# EAGLE design RFID-Parking-System (EAGLE 6.4)
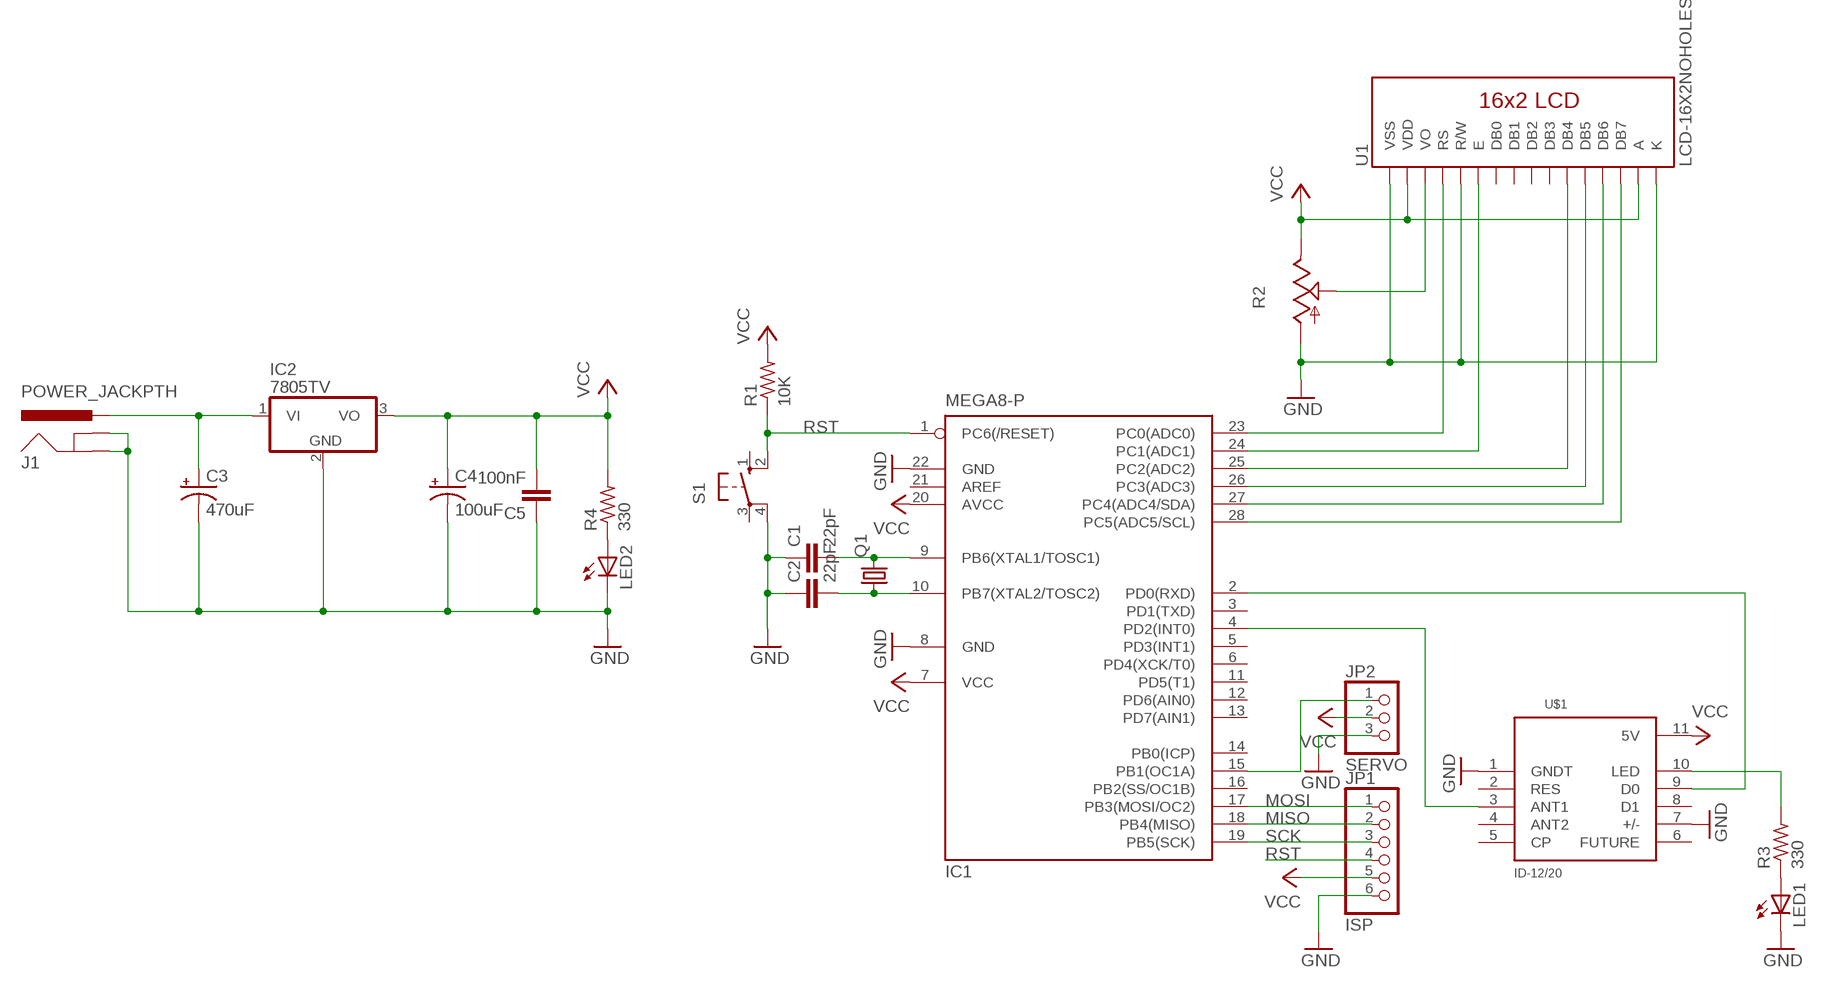
[diagram p0: schematic, sheet 1]

## Parts
C1  22pF  C-EU025-024X044  [C025-024X044]
C2  22pF  C-EU025-024X044  [C025-024X044]
C3  470uF  CPOL-USE2.5-6  [E2,5-6]
C4  100uF  CPOL-USE2.5-6  [E2,5-6]
C5  100nF  C-EU025-024X044  [C025-024X044]
IC1  MEGA8-P  [DIL28-3]
IC2  7805TV  [TO220V]
J1  POWER_JACKPTH  [POWER_JACK_PTH]
JP1  ISP  PINHD-1X6  [1X06]
JP2  SERVO  PINHD-1X3  [1X03]
LED1  LED3MM  [LED3MM]
LED2  LED3MM  [LED3MM]
Q1  CRYSTALHC49S  [HC49/S]
R1  10K  R-US_0207/10  [0207/10]
R2  TRIM_US-CA6V  [CA6V]
R3  330  R-US_0207/10  [0207/10]
R4  330  R-US_0207/10  [0207/10]
S1  10-XX  [B3F-10XX]
U1  LCD-16X2NOHOLES  [LCD-16X2_NOHOLES]
U$1  ID-12/20  [ID-12]

## Nets
GND: C1.1 C2.1 C3.- C4.- C5.1 IC1.8(GND) IC1.22(GND) IC2.2(GND) J1.GND J1.GNDBREAK JP1.6 JP2.3 LED1.K(C) LED2.K(C) R2.A S1.4(P1) U1.1(VSS) U1.5(R/W) U1.16(K) U$1.1(GNDT) U$1.7(+/-)
MISO: IC1.18(PB4(MISO)) JP1.2
MOSI: IC1.17(PB3(MOSI/OC2)) JP1.1
N$1: C1.2 IC1.9(PB6(XTAL1/TOSC1)) Q1.2
N$2: C2.2 IC1.10(PB7(XTAL2/TOSC2)) Q1.1
N$3: IC1.15(PB1(OC1A)) JP2.1
N$5: R2.S U1.3(VO)
N$6: IC1.23(PC0(ADC0)) U1.4(RS)
N$7: IC1.24(PC1(ADC1)) U1.6(E)
N$8: IC1.25(PC2(ADC2)) U1.11(DB4)
N$9: IC1.26(PC3(ADC3)) U1.12(DB5)
N$10: IC1.27(PC4(ADC4/SDA)) U1.13(DB6)
N$11: IC1.28(PC5(ADC5/SCL)) U1.14(DB7)
N$12: IC1.4(PD2(INT0)) U$1.3(ANT1)
N$13: IC1.2(PD0(RXD)) U$1.9(D0)
N$14: LED1.A R3.1
N$15: R3.2 U$1.10(LED)
N$16: C3.+ IC2.1(VI) J1.PWR
N$17: LED2.A R4.1
RST: IC1.1(PC6(/RESET)) JP1.4 R1.1 S1.2(S1)
SCK: IC1.19(PB5(SCK)) JP1.3
VCC: C4.+ C5.2 IC1.7(VCC) IC1.20(AVCC) IC2.3(VO) JP1.5 JP2.2 R1.2 R2.E R4.2 U1.2(VDD) U1.15(A) U$1.11(5V)
Unconnected: IC1.3(PD1(TXD)) IC1.5(PD3(INT1)) IC1.6(PD4(XCK/T0)) IC1.11(PD5(T1)) IC1.12(PD6(AIN0)) IC1.13(PD7(AIN1)) IC1.14(PB0(ICP)) IC1.16(PB2(SS/OC1B)) IC1.21(AREF) S1.1(S) S1.3(P) U1.7(DB0) U1.8(DB1) U1.9(DB2) U1.10(DB3) U$1.2(RES) U$1.4(ANT2) U$1.5(CP) U$1.6(FUTURE) U$1.8(D1)

## Library data of the parts
C1 C2 C5 = resistor:C-EU: CAPACITOR, European symbol
C3 C4 = rcl:CPOL-US: POLARIZED CAPACITOR, American symbol
IC1 = atmel:MEGA8-P: MICROCONTROLLER 8 Kbytes FLASH, 1 kbytes SRAM, 512 bytes EEPROM, USART, 4-channel 10 bit ADC, 2-channel 8 bit ADC Pin compatible with Atmega48, ATMega88, ATMega168 Source: avr.lbr; OC_FARNELL: unknown; OC_NEWARK: unknown
IC2 = linear:78*: Positive VOLTAGE REGULATOR Source: http://cache.national.com/ds/LM/LM78L05.pdf http://www.fairchildsemi.com/ds/LM/LM7805.pdf
J1 = SparkFun-Connectors:POWER_JACK: Power Jack This is the standard 5.5mm barrel jack for power. The PTH is the most common, proven, reliable, footprint. The Slot footprint only works if the mill layer is transmitted to the PCB fab house so be warned. Mating wall wart : TOL-00298 (and others); PROD_ID: PRT-00119
JP1 = pinhead:PINHD-1X6: PIN HEADER
JP2 = pinhead:PINHD-1X3: PIN HEADER
LED1 LED2 = led:LED: LED OSRAM: - CHIPLED LG R971, LG N971, LY N971, LG Q971, LY Q971, LO R971, LY R971 LH N974, LH R974 LS Q976, LO Q976, LY Q976 LO Q996 - Hyper CHIPLED LW Q18S LB Q993, LB Q99A, LB R99A - SideLED LS A670, LO A670, LY A670, LG A670, LP A670 LB A673, LV A673, LT A673, LW A673 LH A674 LY A675 LS A676, LA A676, LO A676, LY A676, LW A676 LS A679, LY A679, LG A679 - Hyper Micro SIDELED® LS Y876, LA Y876, LO Y876, LY Y876 LT Y87S - SmartLED LW L88C, LW L88S LB L89C, LB L89S, LG L890 LS L89K, LO L89K, LY L89K LS L896, LA L896, LO L896, LY L896 - TOPLED LS T670, LO T670, LY T670, LG T670, LP T670 LSG T670, LSP T670, LSY T670, LOP T670, LYG T670 LG T671, LOG T671, LSG T671 LB T673, LV T673, LT T673, LW T673 LH T674 LS T676, LA T676, LO T676, LY T676, LB T676, LH T676, LSB T676, LW T676 LB T67C, LV T67C, LT T67C, LS T67K, LO T67K, LY T67K, LW E67C LS E67B, LA E67B, LO E67B, LY E67B, LB E67C, LV E67C, LT E67C LW T67C LS T679, LY T679, LG T679 LS T770, LO T770, LY T770, LG T770, LP T770 LB T773, LV T773, LT T773, LW T773 LH T774 LS E675, LA E675, LY E675, LS T675 LS T776, LA T776, LO T776, LY T776, LB T776 LHGB T686 LT T68C, LB T68C - Hyper Mini TOPLED® LB M676 - Mini TOPLED Santana® LG M470 LS M47K, LO M47K, LY M47K Source: http://www.osram.convergy.de LUXEON: - LUMILED® LXK2-PW12-R00, LXK2-PW12-S00, LXK2-PW14-U00, LXK2-PW14-V00 LXK2-PM12-R00, LXK2-PM12-S00, LXK2-PM14-U00 LXK2-PE12-Q00, LXK2-PE12-R00, LXK2-PE12-S00, LXK2-PE14-T00, LXK2-PE14-U00 LXK2-PB12-K00, LXK2-PB12-L00, LXK2-PB12-M00, LXK2-PB14-N00, LXK2-PB14-P00, LXK2-PB14-Q00 LXK2-PR12-L00, LXK2-PR12-M00, LXK2-PR14-Q00, LXK2-PR14-R00 LXK2-PD12-Q00, LXK2-PD12-R00, LXK2-PD12-S00 LXK2-PH12-R00, LXK2-PH12-S00 LXK2-PL12-P00, LXK2-PL12-Q00, LXK2-PL12-R00 Source: www.luxeon.com KINGBRIGHT: KA-3528ASYC Source: www.kingbright.com
Q1 = crystal:CRYSTAL: CRYSTAL; OC_FARNELL: 1667008; OC_NEWARK: unknown
R1 R3 R4 = resistor:R-US_: RESISTOR, American symbol
R2 = pot:TRIM_US-: POTENTIOMETER
S1 = switch-omron:10-XX: OMRON SWITCH; MPN: B3F-1000; OC_FARNELL: 176432; OC_NEWARK: 36M3542
U1 = SparkFun-Displays:LCD-16X2: Standard text-only 16x2 parallel input LCD
U$1 = SparkFun-RF:ID-12/20: RFID reader for ID2, ID12, and ID20 Package

## Board
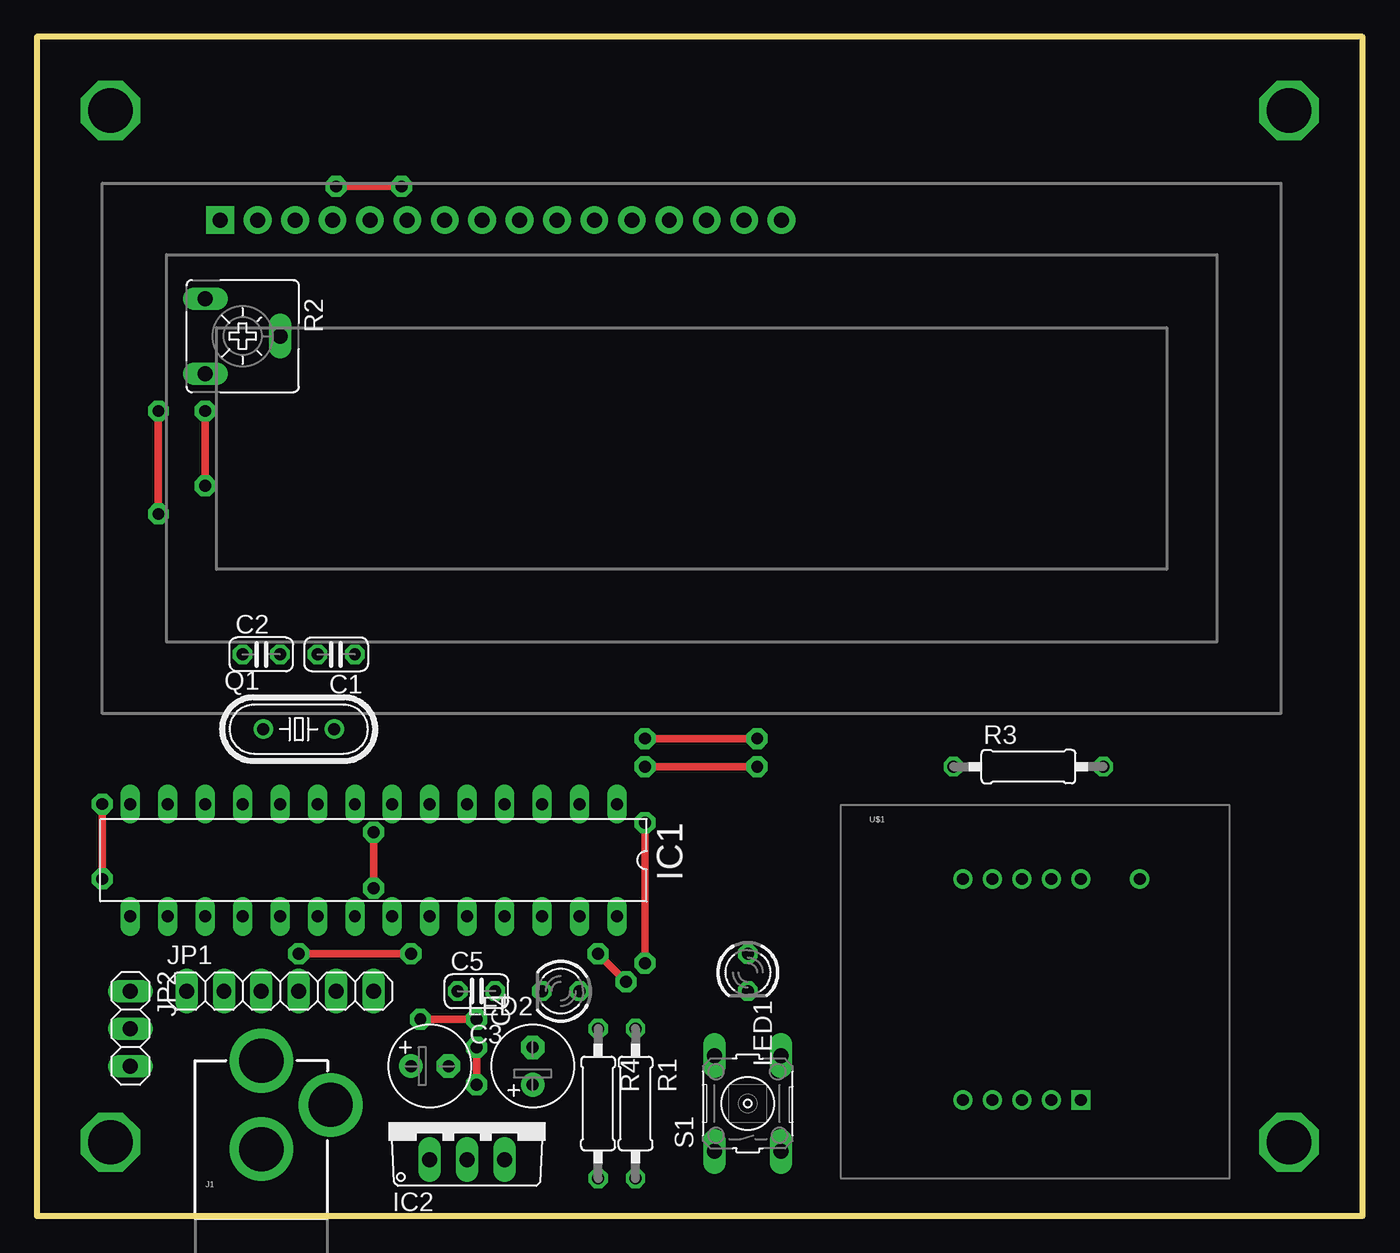
[diagram p1: board, top side]
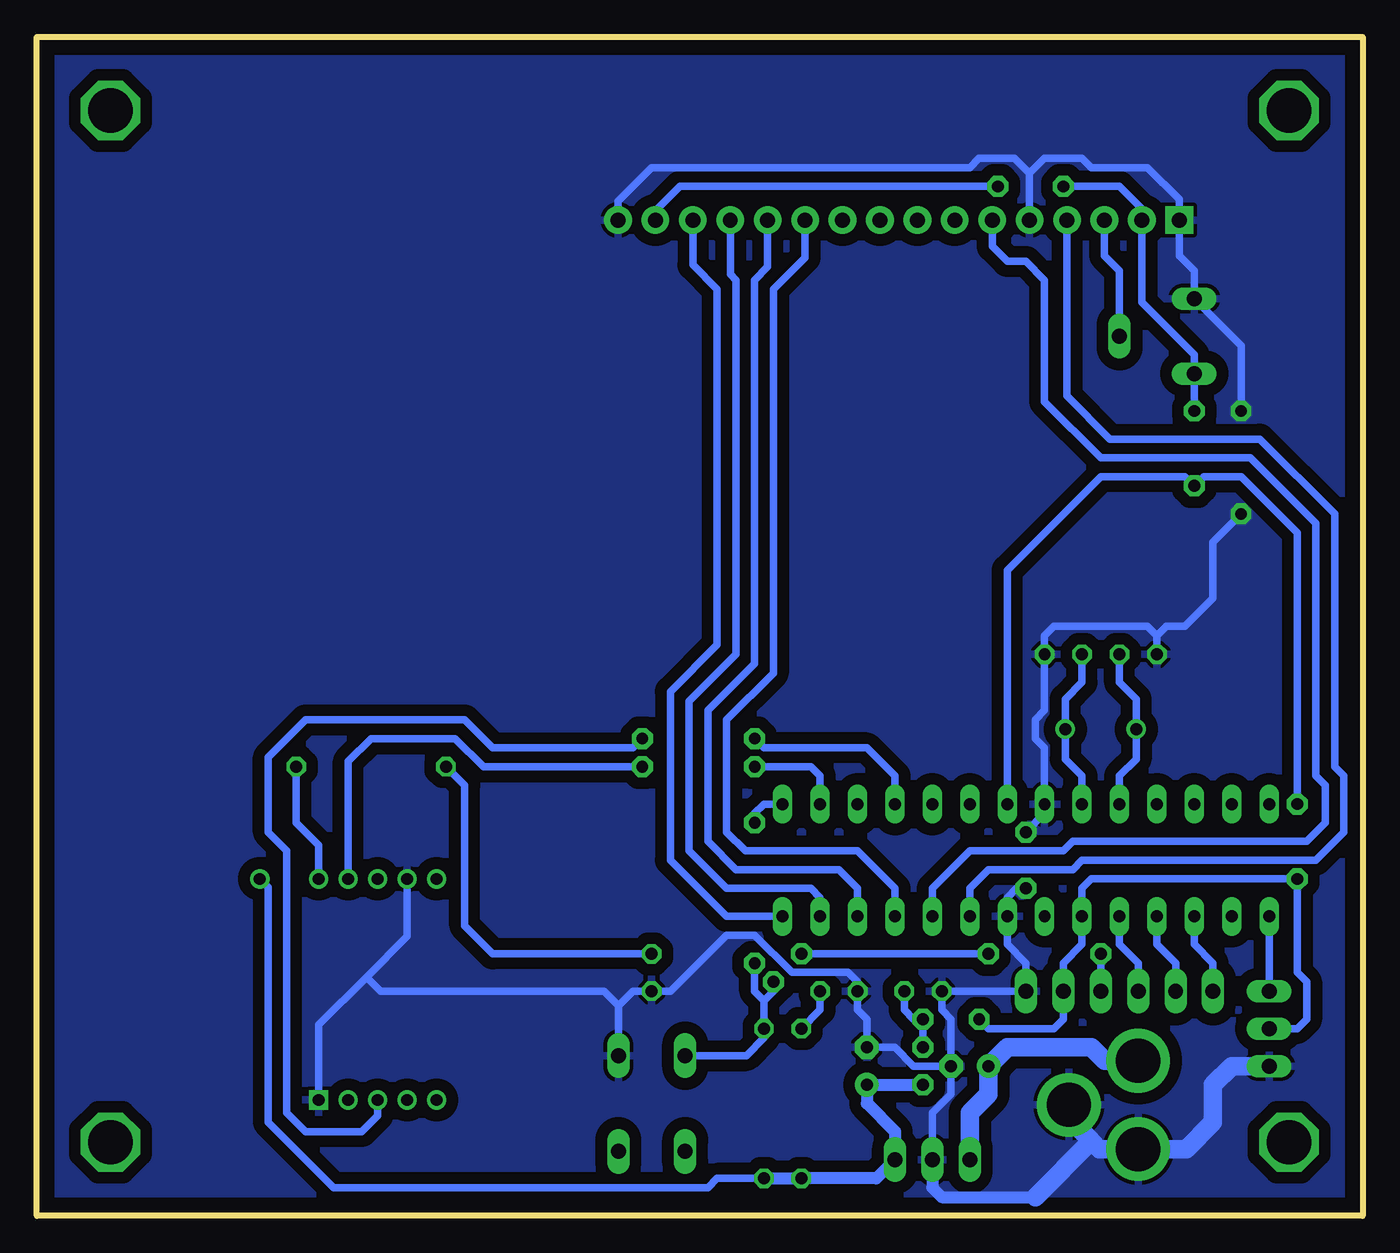
[diagram p2: board, bottom side, seen from below]

Size 90 x 80 mm. Coordinates in mm from the lower left corner, seen from the top.
Outline: 0,0 90,0 90,80 0,80 0,0
Copper layers (1*16): Top 0.035mm / dielectric 1.5mm / Bottom 0.035mm
Design rules "default": minimum track width 10mil, minimum drill 24mil, track to track 8mil, track to pad 8mil, pad to pad 8mil, via to via 8mil, smd to smd 8mil, copper to edge 40mil, drill to drill 8mil, minimum pad ring 10mil, minimum via ring 8mil, stop-mask expansion 4mil, vias tented up to drill 0mil, thermal gap 10mil

### Footprints (pad centres in the part's own frame; a part is rotated, then mirrored left to right if it is on the bottom)
C025-024X044 = drill 0.813 octagon: 1 -1.27,0; 2 1.27,0
E2,5-6 = drill 0.813 pad 1.6: + -1.27,0 | drill 0.813 pad 1.6 octagon: - 1.27,0
DIL28-3 = drill 0.813 long: 1 -16.51,-3.81; 2 -13.97,-3.81; 3 -11.43,-3.81; 4 -8.89,-3.81; 5 -6.35,-3.81; 6 -3.81,-3.81; 7 -1.27,-3.81; 8 1.27,-3.81; 9 3.81,-3.81; 10 6.35,-3.81; 11 8.89,-3.81; 12 11.43,-3.81; 13 13.97,-3.81; 14 16.51,-3.81; 15 16.51,3.81; 16 13.97,3.81; 17 11.43,3.81; 18 8.89,3.81; 19 6.35,3.81; 20 3.81,3.81; 21 1.27,3.81; 22 -1.27,3.81; 23 -3.81,3.81; 24 -6.35,3.81; 25 -8.89,3.81; 26 -11.43,3.81; 27 -13.97,3.81; 28 -16.51,3.81
TO220V = drill 1.016 long: 1 -2.54,-2.54; 2 0,-2.54; 3 2.54,-2.54
POWER_JACK_PTH = drill 2.997 pad 4.318: GND 0,7.7; GNDBREAK 4.7,10.7; PWR 0,13.7
1X06 = drill 1.016 long: 1 -6.35,0; 2 -3.81,0; 3 -1.27,0; 4 1.27,0; 5 3.81,0; 6 6.35,0
1X03 = drill 1.016 long: 1 -2.54,0; 2 0,0; 3 2.54,0
LED3MM = drill 0.813 octagon: A -1.27,0; K 1.27,0
HC49/S = drill 0.813: 1 -2.413,0; 2 2.413,0
0207/10 = drill 0.813 octagon: 1 -5.08,0; 2 5.08,0
CA6V = drill 1.016 long: A -2.54,-2.54; E 2.54,-2.54; S 0,2.54
B3F-10XX = drill 1.016 long: 1 -3.251,2.261; 2 3.251,2.261; 3 -3.251,-2.261; 4 3.251,-2.261
LCD-16X2_NOHOLES = drill 1.016 pad 1.88 square: 1 -32,15.5 | drill 1.016 pad 1.88: 2 -29.46,15.5; 3 -26.92,15.5; 4 -24.38,15.5; 5 -21.84,15.5; 6 -19.3,15.5; 7 -16.76,15.5; 8 -14.22,15.5; 9 -11.68,15.5; 10 -9.14,15.5; 11 -6.6,15.5; 12 -4.06,15.5; 13 -1.52,15.5; 14 1.02,15.5; 15 3.56,15.5; 16 6.1,15.5
ID-12 = drill 0.8 square: 1 16.255,5.32 | drill 0.8: 2 14.255,5.32; 3 12.255,5.32; 4 10.255,5.32; 5 8.255,5.32; 6 8.255,20.32; 7 10.255,20.32; 8 12.255,20.32; 9 14.255,20.32; 10 16.255,20.32; 11 20.255,20.32

### Placement (x,y rotation side)
C1  20.32,38.1 180 top
C2  15.24,38.1 0 top
C3  26.67,10.16 0 top
C4  33.66,10.16 90 top
C5  29.84,15.24 0 top
IC1  22.86,24.13 180 top
IC2  29.21,6.35 0 top
J1  15.24,-3.17 0 top
JP1  16.51,15.24 0 top
JP2  6.35,12.7 270 top
LED1  48.26,16.51 270 top
LED2  35.56,15.24 180 top
Q1  17.78,33.02 0 top
R1  40.64,7.62 270 top
R2  13.97,59.69 270 top
R3  67.31,30.48 0 top
R4  38.1,7.62 270 top
S1  48.26,7.62 90 top
U1  44.45,52.07 0 top
U$1  54.61,2.54 0 top

### Tracks (layer width: path | path; a pad name or v marks a point on that pad's centre or on a via)
GND  (via drill 0.8 pad 1.42)
  Top 0.5: v8.26,54.61 v8.26,47.62 | v22.86,26.04 v22.86,22.23
  Bottom 0.5: U1.5 22.61,70.73 | 22.61,70.73 21.59,71.75 19.05,71.75 18.41,71.12 14.61,71.12 12.45,68.97 U1.1 12.45,65.16 11.43,64.14 R2.A 8.26,59.05 v8.26,54.61 | U1.16 50.55,68.83 48.26,71.12 26.67,71.12 26.04,71.75 23.63,71.75 22.61,70.73 | C2.1 13.97,39.37 | 13.97,39.37 14.61,40.01 20.95,40.01 21.59,39.37 C1.1 21.59,34.29 22.23,33.66 22.23,32.38 21.59,31.75 IC1.8 21.59,27.3 v22.86,26.04 | S1.4 50.52,14.25 | U$1.7 64.86,18.95 67.63,16.19 | 67.63,16.19 70.86,12.96 U$1.1 | 50.52,14.25 51.51,15.24 66.67,15.24 67.63,16.19 | 50.52,14.25 49.53,15.24 LED1.K 46.99,15.24 43.18,19.05 41.27,19.05 38.73,16.51 34.92,16.51 34.29,15.88 LED2.K 34.29,13.97 33.66,13.34 C4.- 31.75,11.43 30.48,10.16 C3.- | C3.- 27.94,8.26 29.21,6.99 IC2.2 | C3.- 27.94,13.34 28.57,13.97 C5.1 JP1.6 22.86,17.14 24.13,18.41 IC1.22 24.13,21.59 23.5,22.23 v22.86,22.23 | 13.97,39.37 13.34,40.01 12.06,40.01 10.16,41.91 10.16,45.72 v8.26,47.62
  Bottom 0.813: 22.23,1.27 28.57,1.27 29.21,1.91 IC2.2
  Bottom 1.27: JP2.3 8.89,10.16 10.16,8.89 10.16,6.35 11.98,4.53 J1.GND 17.86,4.53 18.41,5.08 | J1.GNDBREAK 19.94,6.61 18.41,5.08 | 22.23,1.27 18.41,5.08
  pour Bottom (isolate 0.8): 0,0 90,0 90,80 0,80
MISO
  Bottom 0.5: JP1.2 12.7,17.14 13.97,18.41 IC1.18
MOSI
  Bottom 0.5: JP1.1 10.16,17.14 11.43,18.41 IC1.17
N$1
  Bottom 0.5: IC1.9 19.05,29.84 20.19,30.99 Q1.2 20.19,35.05 19.05,36.2 C1.2
N$2
  Bottom 0.5: IC1.10 16.51,29.84 15.37,30.99 Q1.1 15.37,35.05 16.51,36.2 C2.2
N$3
  Bottom 0.5: JP2.1 IC1.15
N$4
  pour Bottom (isolate 0.8): 0,0 90,0 90,80 0,80
N$5
  Bottom 0.5: U1.3 17.53,65.16 16.51,64.14 R2.S
N$6
  Bottom 0.5: U1.4 20.07,55.63 17.14,52.7 6.99,52.7 1.91,47.62 1.91,30.48 1.27,29.84 1.27,26.04 3.17,24.13 19.05,24.13 19.68,23.5 25.4,23.5 26.67,22.23 IC1.23
N$7
  Bottom 0.5: U1.6 25.15,65.79 24.13,64.77 22.86,64.77 21.59,63.5 21.59,55.24 17.78,51.44 7.62,51.44 3.17,46.99 3.17,29.84 2.54,29.21 2.54,26.67 3.81,25.4 19.68,25.4 20.32,24.77 26.67,24.77 29.21,22.23 IC1.24
N$8
  Bottom 0.5: IC1.25 31.75,22.23 34.29,24.77 41.91,24.77 43.18,26.04 43.18,33.66 40.01,36.83 40.01,62.87 37.85,65.02 U1.11
N$9
  Bottom 0.5: IC1.26 34.29,22.23 35.56,23.5 42.55,23.5 44.45,25.4 44.45,34.29 41.27,37.47 41.27,63.5 40.39,64.39 U1.12
N$10
  Bottom 0.5: IC1.27 36.83,21.59 37.47,22.23 43.18,22.23 45.72,24.77 45.72,34.92 42.55,38.1 42.55,63.5 42.93,63.88 U1.13
N$11
  Bottom 0.5: IC1.28 43.18,20.32 46.99,24.13 46.99,35.56 43.81,38.73 43.81,62.87 45.47,64.52 U1.14
N$12  (via drill 0.8 pad 1.42)
  Top 0.5: v41.27,32.38 v48.9,32.38
  Bottom 0.5: U$1.3 66.86,6.79 67.94,5.71 71.75,5.71 73.03,6.99 73.03,24.77 74.3,26.04 74.3,31.11 71.75,33.66 60.96,33.66 59.05,31.75 49.53,31.75 v48.9,32.38 | IC1.4 31.75,29.84 33.66,31.75 40.64,31.75 v41.27,32.38
N$13  (via drill 0.8 pad 1.42)
  Top 0.5: v41.27,30.48 v48.9,30.48
  Bottom 0.5: U$1.9 68.86,30.83 67.31,32.38 61.59,32.38 59.69,30.48 v48.9,30.48 | IC1.2 36.83,29.84 37.47,30.48 v41.27,30.48
N$14
  Bottom 0.5: LED1.A 59.05,17.78 60.96,19.68 60.96,29.21 R3.1
N$15
  Bottom 0.5: U$1.10 70.86,25.14 72.39,26.67 R3.2
N$16
  Bottom 1.27: IC2.1 26.67,6.99 25.4,8.26 C3.+ 24.13,11.43 18.41,11.43 17.51,10.53 J1.PWR
N$17
  Bottom 0.5: R4.1 36.83,13.97 LED2.A
N$18  (via drill 3)
  other vias: 5,75
N$19  (via drill 3)
  other vias: 85,75
N$20  (via drill 3)
  other vias: 85,5
N$21  (via drill 3)
  other vias: 5,5
RST  (via drill 0.8 pad 1.42)
  Top 0.5: v41.27,26.67 v41.27,17.14 | v17.78,17.78 v25.4,17.78 | v38.1,17.78 v40.01,15.88
  Bottom 0.5: JP1.4 v17.78,17.78 | S1.2 41.83,10.87 40.64,12.06 R1.1 40.64,14.61 | 40.64,14.61 41.27,15.24 v41.27,17.14 | v41.27,26.67 41.27,27.3 40.64,27.94 IC1.1 | v25.4,17.78 v38.1,17.78 | v40.01,15.88 40.01,15.24 40.64,14.61
SCK
  Bottom 0.5: JP1.3 15.24,17.14 16.51,18.41 IC1.19
VCC  (via drill 0.8 pad 1.42)
  Top 0.5: v11.43,54.61 v11.43,49.53 | v26.04,13.34 v29.84,13.34 | v29.84,11.43 v29.84,8.89 | v20.32,69.85 v24.77,69.85 | v4.45,27.94 v4.45,22.86
  Bottom 0.5: R1.2 43.81,2.54 44.45,1.91 69.85,1.91 74.3,6.35 74.3,22.29 U$1.11 | JP2.2 4.45,12.7 3.81,13.34 3.81,15.88 4.45,16.51 v4.45,22.86 18.41,22.86 19.05,22.23 IC1.20 19.05,18.41 20.32,17.14 JP1.5 20.32,13.34 20.95,12.7 25.4,12.7 v26.04,13.34 | IC1.7 24.13,43.81 17.78,50.16 12.06,50.16 v11.43,49.53 10.79,50.16 8.26,50.16 4.45,46.35 v4.45,27.94 | v11.43,54.61 R2.E 11.43,58.42 14.99,61.98 U1.2 14.99,68.33 16.51,69.85 v20.32,69.85 | U1.15 48.01,68.19 46.35,69.85 v24.77,69.85 | C5.2 31.11,13.97 30.48,13.34 v29.84,13.34 v29.84,11.43
  Bottom 0.813: R1.2 R4.2 33.02,2.54 IC2.3 31.75,5.71 33.66,7.62 C4.+ v29.84,8.89